# Altium schematic sheet FTDI_ISP.SchDoc
size A
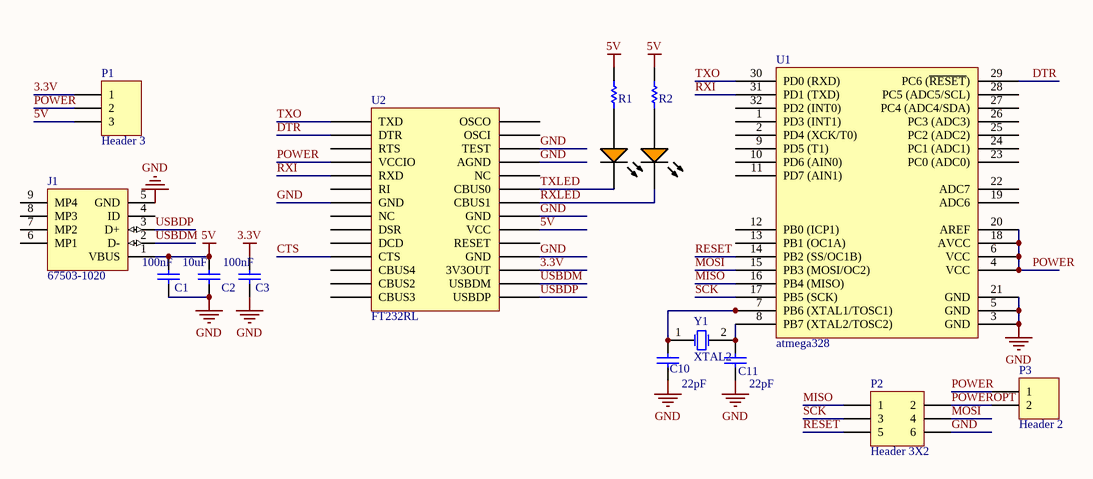
[diagram p0: FTDI_ISP.SchDoc]

## Parts
C1  100nF  [CAPC0603(1608)100_N]
C2  10uF  [CAPC0603(1608)100_N]
C3  100nF  [CAPC0603(1608)100_N]
C10  22pF  [CAPC0603(1608)100_M]
C11  22pF  [CAPC0603(1608)100_M]
D1  APG1608SEKC/T  [KING-LED0603-25-ORANGE_V]  (value not drawn)
D2  APG1608SEKC/T  [KING-LED0603-25-ORANGE_V]  (value not drawn)
J1  67503-1020  [MOLX-67503-1020_V]
P1  Header 3  [HDR1X3]
P2  Header 3X2  [HDR2X3]
P3  Header 2  [HDR1X2]
R1  1K1 5% 0603(1608)  [RESC0603(1608)_L]  (value not drawn)
R2  1K1 5% 0603(1608)  [RESC0603(1608)_L]  (value not drawn)
U1  atmega328  [atmega44/88/168]
U2  FT232RL  [FT232RL-SOP]
Y1  XTAL2  [HC49/US]

## Nets
3.3V: C3.2 P1.1 U2.17(3V3OUT)
5V: C1.2 C2.2 J1.1(VBUS) P1.3 R1.1 R2.1 U2.20(VCC)
GND: C1.1 C2.1 C3.1 C10.1 C11.1 J1.5(GND) P2.6 U1.3(GND) U1.5(GND) U1.21(GND) U2.7(GND) U2.18(GND) U2.21(GND) U2.25(AGND) U2.26(TEST)
CTS: U2.11(CTS)
DTR: U1.29(PC6_(~{RESET})) U2.2(DTR)
MISO: P2.1 U1.16(PB4_(MISO))
MOSI: P2.4 U1.15(PB3_(MOSI/OC2))
POWER: P1.2 P3.1 U1.4(VCC) U1.6(VCC) U1.18(AVCC) U1.20(AREF) U2.4(VCCIO)
POWEROPT: P2.2 P3.2
RESET: P2.5 U1.14(PB2_(SS/OC1B))
RXI: U1.31(PD1_(TXD)) U2.5(RXD)
RXLED: D2.2(K) U2.22(CBUS1)
SCK: P2.3 U1.17(PB5_(SCK))
TXLED: D1.2(K) U2.23(CBUS0)
TXO: U1.30(PD0_(RXD)) U2.1(TXD)
USBDM: J1.2(D-) U2.16(USBDM)
USBDP: J1.3(D+) U2.15(USBDP)
NetC10_2: C10.2 U1.7(PB6_(XTAL1/TOSC1)) Y1.1(OSC1)
NetC11_2: C11.2 U1.8(PB7_(XTAL2/TOSC2)) Y1.2(OSC2)
NetD1_1: D1.1(A) R1.2
NetD2_1: D2.1(A) R2.2

Not connected (* = marked no-connect by the designer): J1 4(ID) 6(MP1) 7(MP2) 8(MP3) 9(MP4); U1 1(PD3_(INT1)) 2(PD4_(XCK/T0)) 9(PD5_(T1)) 10(PD6_(AIN0)) 11(PD7_(AIN1)) 12(PB0_(ICP1)) 13(PB1_(OC1A)) 19(ADC6) 22(ADC7) 23(PC0_(ADC0)) 24(PC1_(ADC1)) 25(PC2_(ADC2)) 26(PC3_(ADC3)) 27(PC4_(ADC4/SDA)) 28(PC5_(ADC5/SCL)) 32(PD2_(INT0)); U2 3(RTS) 6(RI) 8(NC) 9(DSR) 10(DCD) 12(CBUS4) 13(CBUS2) 14(CBUS3) 19(RESET) 24(NC) 27(OSCI) 28(OSCO)

## Library data of the parts
C1 C3 = CMP-1035-02582-1: CAP 100nF 10V -20% to +80% 0603 (1608 Metric) Thickness 1mm SMD; Case-Metric: 1608; Case-EIA: 0603; Rated Voltage: 10 V; Value: 100nF; Technology: SMT; Max Thickness: 1 mm; Tolerance: -20% to +80%
C2 = CMP-1035-02799-1: CAP 10uF 10V ±10% 0603 (1608 Metric) Thickness 1mm SMD; Case-Metric: 1608; Case-EIA: 0603; Max Thickness: 1 mm; Tolerance: ±10%; Technology: SMT; Rated Voltage: 10 V; Value: 10uF
C10 C11 = CMP-1035-00797-1: CAP 22pF 10V ±0.25pF 0603 (1608 Metric) Thickness 1mm SMD; Case-Metric: 1608; Case-EIA: 0603; Tolerance: ±0.25pF; Max Thickness: 1 mm; Technology: SMT; Value: 22pF; Rated Voltage: 10 V
D1 D2 = CMP-0239-00002-1: LED, SMT, 0603(1608), 0.25mm Tthickness, Super Bright Orange; Forward Current: 30 mA; Power Dissipation: 75 mW; Reverse Voltage: 5 V; Packing: Reel; PackageDescription: 2-Pin SMT LED, 1.6 x 0.8 mm Body, 0.25mm Thickness; ComponentLink1URL: http://www.kingbrightusa.com/; PackageVersion: Rev. 4A, 12/2011; Storage Temperature: -40 to 85 degC; PartNumber: APG1608SEKC/T; Mounting Technology: Surface Mount; ComponentLink2Description: Datasheet; DatasheetVersion: Rev. 4A, 12/2011; ComponentLink2URL: http://www.kingbrightusa.com/images/catalog/SPEC/APG1608SEKC-T.pdf; PackageReference: LED0603-25-ORANGE; ComponentLink1Description: Manufacturer URL
J1 = CMP-0411-00002-1: USB, MINI, SMD, RA KME04-USBMU03A01; Manufacturer: Molex; ComponentLink1URL: http://www.molex.com/; PartNumber: 67503-1020; Mounting Technology: Surface Mount; ComponentLink1Description: Manufacturer URL; Terminal Pitch: 0.8 mm; DatasheetVersion: Rev F, 06/2009; ComponentLink2Description: Datasheet; PackageDescription: Mini USB Connector, SMT, Righer Angle; ComponentLink2URL: http://www.molex.com/pdm_docs/sd/675031020_sd.pdf; PackageReference: 67503-1020
P1 = Header 3: Header, 3-Pin; LatestRevisionDate: 17-Jul-2002; LatestRevisionNote: Re-released for DXP Platform.; Publisher: Altium Limited
P2 = Header 3X2: Header, 3-Pin, Dual row; LatestRevisionDate: 17-Jul-2002; LatestRevisionNote: Re-released for DXP Platform.; Publisher: Altium Limited
P3 = Header 2: Header, 2-Pin; LatestRevisionDate: 17-Jul-2002; LatestRevisionNote: Re-released for DXP Platform.; Publisher: Altium Limited
R1 R2 = CMP-1012-00075-1: 1K1 0.1W 5% 0603 (1608 Metric)  SMD; Case-Metric: 1608; Value: 1100.00 Ohm; Case-EIA: 0603; Power: 0.1 W; Technology: SMT; Tolerance: 5 %
U1 = atmega88
Y1 = XTAL2: Two Lead Crystal Oscillator